# EAGLE design ALSN v1 (EAGLE 9.5.0)
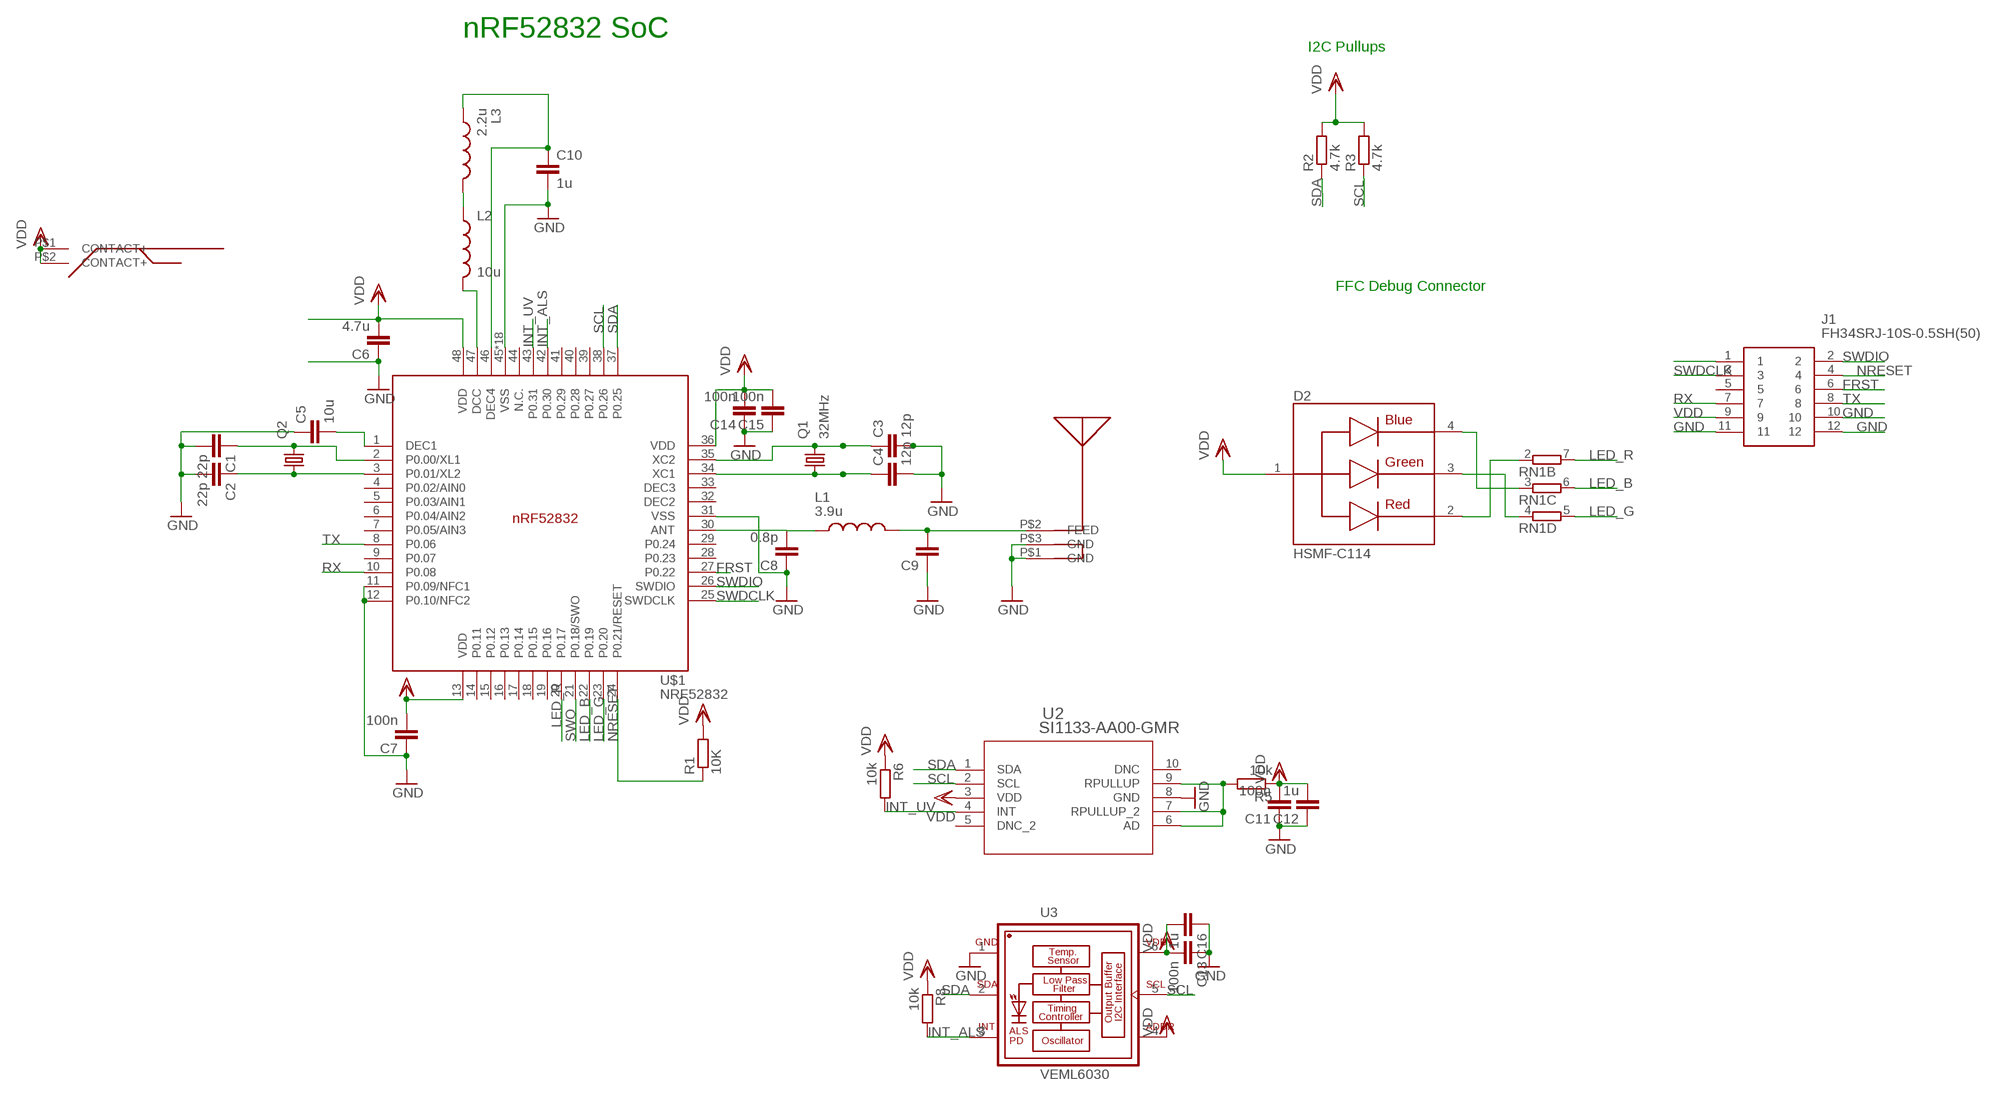
[diagram p0: schematic, sheet 1]

## Parts
C1  22p  CC0402  [C0402]
C2  22p  CC0402  [C0402]
C3  12p  CC0402  [C0402]
C4  12p  CC0402  [C0402]
C5  10u  CC0402  [C0402]
C6  4.7u  CC0402  [C0402]
C7  100n  CC0603R  [C0603R]
C8  0.8p  CC0402  [C0402]
C9  1.2p  CC0402  [C0402]
C10  1u  CC0402  [C0402]
C11  100n  CC0402  [C0402]
C12  1u  CC0402  [C0402]
C13  100n  CC0402  [C0402]
C14  100n  CC0402  [C0402]
C15  100n  CC0402  [C0402]
C16  1u  CC0402  [C0402]
D2  HSMF-C114  [DIOSC160X150X35-4N]
J1  FH34SRJ-10S-0.5SH(50)  [FH34SRJ10S05SH50]
L1  3.9u  MHQ0402P7N5JT000  [INDC0402X26N]
L2  10u  INDUCTOR  [L0603]
L3  2.2u  MHQ0402P7N5JT000  [INDC0402X26N]
Q1  32MHz  KX-5  [2.0X1.6_KX-5]
Q2  KX-327-RT  [2.0X1.2]
R1  10K  RR0402  [R0402]
R2  4.7k  RR0402  [R0402]
R3  4.7k  RR0402  [R0402]
R5  10k  RR0402  [R0402]
R6  10k  RR0402  [R0402]
R8  10k  RR0402  [R0402]
RN1  4R-N0402ARV341  [4X0402ARV341]
U2  SI1133-AA00-GMR  [10QFN_2X2_SIL]
U3  VEML6030  [VISHAY_VEML6030_2X2X0.87]
U$1  NRF52832  [QFN40P600X600X90-48_N]
U$2  CR2032-THT  [CR2032-THT]
U$4  CHIPANTENNAL2  [CHIPANTENNAL2]

## Nets
FRST: J1.6 U$1.27(P0.22)
GND: C1.2 C2.2 C3.2 C4.2 C5.1 C6.1 C7.1 C8.1 C9.1 C10.2 C11.1 C12.1 C13.1 C14.1 C15.1 C16.1 J1.10 J1.11 J1.12 U2.8(GND) U3.1(GND) U$1.11(P0.09/NFC1) U$1.12(P0.10/NFC2) U$1.31(VSS) U$1.45(VSS) U$1.PAD(VSS) U$1.PAD@VIA01(VSS) U$1.PAD@VIA02(VSS) U$1.PAD@VIA03(VSS) U$1.PAD@VIA04(VSS) U$1.PAD@VIA05(VSS) U$1.PAD@VIA06(VSS) U$1.PAD@VIA07(VSS) U$1.PAD@VIA08(VSS) U$1.PAD@VIA09(VSS) U$1.PAD@VIA10(VSS) U$1.PAD@VIA11(VSS) U$1.PAD@VIA12(VSS) U$1.PAD@VIA13(VSS) U$1.PAD@VIA14(VSS) U$1.PAD@VIA15(VSS) U$1.PAD@VIA16(VSS) U$4.P$1(GND) U$4.P$3(GND)
INT_ALS: R8.2 U3.3(INT) U$1.42(P0.30)
INT_UV: R6.2 U2.4(INT) U$1.43(P0.31)
LED_B: RN1.6 U$1.22(P0.19)
LED_G: RN1.5 U$1.23(P0.20)
LED_R: RN1.7 U$1.20(P0.17)
N$1: C1.1 Q2.2 U$1.2(P0.00/XL1)
N$2: C2.1 Q2.1 U$1.3(P0.01/XL2)
N$3: C3.1 Q1.3 U$1.35(XC2)
N$4: C4.1 Q1.1 U$1.34(XC1)
N$5: C5.2 U$1.1(DEC1)
N$6: C8.2 L1.1 U$1.30(ANT)
N$9: L2.2 U$1.47(DCC)
N$10: L2.1 L3.2
N$11: C10.1 L3.1 U$1.46(DEC4)
N$12: D2.3 RN1.4
N$15: R5.2 U2.6(AD) U2.7(RPULLUP_2) U2.9(RPULLUP)
N$16: D2.2 RN1.2
N$17: J1.1
N$18: D2.4 RN1.3
NRESET: J1.4 R1.1 U$1.24(P0.21/RESET)
RF: C9.2 L1.2 U$4.P$2(FEED)
RX: J1.7 U$1.10(P0.08)
SCL: R3.1 U2.2(SCL) U3.5(SCL) U$1.38(P0.26)
SDA: R2.1 U2.1(SDA) U3.2(SDA) U$1.37(P0.25)
SWDCLK: J1.3 U$1.25(SWDCLK)
SWDIO: J1.2 U$1.26(SWDIO)
SWO: U$1.21(P0.18/SWO)
TX: J1.8 U$1.8(P0.06)
VDD: C6.2 C7.2 C11.2 C12.2 C13.2 C14.2 C15.2 C16.2 D2.1 J1.9 R1.2 R2.2 R3.2 R5.1 R6.1 R8.1 U2.3(VDD) U3.4(ADDR) U3.6(VDD) U$1.13(VDD) U$1.36(VDD) U$1.48(VDD) U$2.P$1(CONTACT+) U$2.P$2(CONTACT+)
Unconnected: J1.5 RN1.1 RN1.8 U2.5(DNC_2) U2.10(DNC) U$1.4(P0.02/AIN0) U$1.5(P0.03/AIN1) U$1.6(P0.04/AIN2) U$1.7(P0.05/AIN3) U$1.9(P0.07) U$1.14(P0.11) U$1.15(P0.12) U$1.16(P0.13) U$1.17(P0.14) U$1.18(P0.15) U$1.19(P0.16) U$1.28(P0.23) U$1.29(P0.24) U$1.32(DEC2) U$1.33(DEC3) U$1.39(P0.27) U$1.40(P0.28) U$1.41(P0.29) U$1.44(N.C.)

## Notes on the sheet
- nRF52832 SoC
- I2C Pullups
- FFC Debug Connector

## Library data of the parts
C1-C6 C8-C16 = eagle-ltspice:C: CAPACITOR, European symbol; SPICEMODEL: NONE; SPICEPREFIX: C
C7 = eagle-ltspice:C: CAPACITOR, European symbol
D2 = HSMF-C114:HSMF-C114: LED Tri-Color Blue/Green/Red 468nm/523nm/637nm 4-Pin Chip LED T/R; AVAILABILITY: Unavailable; DESCRIPTION: LED RGB DIFFUSED CHIP SMD; MF: Broadcom Limited; MP: HSMF-C114; PACKAGE: 0606 Broadcom; PRICE: None
J1 = FH34SRJ-10S-0.5SH_50_:FH34SRJ-10S-0.5SH(50): HIROSE(HRS) - FH34SRJ-10S-0.5SH(50) - CONNECTOR, FFC/FPC, RCPT, 10POS, 1ROW Source: Datasheet <https://www.hirose.com/product/en/products/FH34SRJ/FH34SRJ-10S-0.5SH(50)/> Check prices <https://pricing.snapeda.com/search/part/FH34SRJ-10S-0.5SH%2850%29/?ref=eda>; AVAILABILITY: Good; DESCRIPTION: FFC & FPC Connectors 10POS 0.50MM R/A CONN FFC FPC; MF: Hirose Connector; MP: FH34SRJ-10S-0.5SH(50); PACKAGE: None; PRICE: None; PURCHASE-URL: https://pricing.snapeda.com/search/part/FH34SRJ-10S-0.5SH(50)/?ref=eda
L1 L3 = MHQ0402P7N5JT000:MHQ0402P7N5JT000: 221 NH 5% GOLD TERMINAL; AVAILABILITY: Unavailable; DESCRIPTION: FIXED IND 7.5NH 200MA 1.2 OHM; MF: TDK; MP: MHQ0402P7N5JT000; PACKAGE: 0402 TDK; PRICE: None
L2 = BeagleBone_Blue_R3:INDUCTOR: Inductors Basic Inductor/Choke - 0603 and 1206. Footprints are not proven and vary greatly between part numbers. SRN6045- 33uH, 20% 1.4A
Q1 = crystal-geyer_V1_0:KX: Quartz Crystals (MHz) SMD: KX - Serie Model Size l/w/h [mm] Frequency Range Frequency Stability Temp. Range [°C] Load Capacitance AECQ 200 availabel Datasheet KX-4 KX-5 KX-6 KX-7 KX-9A KX-9B KX-12A KX-12B KX-13 KX-20 KX-K KX-KS 1.6/1.2/0.3 2.0/1.6/0.45 2.5/2.0/0.55 3.2/2.5/0.8 5.0/3.2/1.0 5.0/3.2/1.1 6.0/3.5/1.1 6.0/3.5/1.0 7.0/5.0 /1.3 11.6/5.5/1.6 12.3/4.5/4.2 12.3/4.5/3.2 24.0 ~ 80.0 MHz 16.0 ~ 80.0 MHz 12.0 ~ 80.0 MHz 8.0 ~ 60.0 MHz 7,68 ~ 300,0 MHz 8,0 ~ 50,0 MHz 8,0 ~ 150,0 MHz 8,0 ~ 50,0 MHz 6,0 ~ 160,0 MHz 3,579 ~ 25,0 MHz 3,579 ~ 70,0 MHz 3,579 ~ 70,0 MHz ±10 … ±50ppm ±10 … ±50ppm ±10 … ±50ppm ±10 … ±50ppm ±10 … ±50ppm ±10 … ±50ppm ±10 … ±50ppm ±10 … ±50ppm ±10 … ±50ppm ±50ppm ±10 … ±50ppm ±10 … ±50ppm (*) -40°C …+85°C (*) -40°C …+125°C (*) -40°C …+125°C (*) -40°C …+125°C (*) -40°C …+105°C (*) -40°C …+105°C (*) -40°C …+125°C (*) -40°C …+105°C (*) -40°C …+105°C (*) -40°C …+105°C (*) -40°C …+85°C (*) -40°C …+85°C 8, 8…16 8, 8…16 10, 8…16 12, 7…20 16, 10…20 16, 10…20 16, 10…20 16, 12…20 16, 12…20 16, 12…20 16, 12…30 16, 12…30 - yes yes yes - - - - - - - - KX-4.pdf <http://www.geyer-electronic.de/uploads/tx_userartikelfrequenz/GEYER-KX-4.pdf> KX-5.pdf <http://www.geyer-electronic.de/uploads/tx_userartikelfrequenz/GEYER-KX-5.pdf> KX-6.pdf <http://www.geyer-electronic.de/uploads/tx_userartikelfrequenz/GEYER-KX-6.pdf> KX-7.pdf <http://www.geyer-electronic.de/uploads/tx_userartikelfrequenz/GEYER-KX-7.pdf> KX-9A.pdf <http://www.geyer-electronic.de/uploads/tx_userartikelfrequenz/GEYER-KX-9A.pdf> KX-9B.pdf <http://www.geyer-electronic.de/uploads/tx_userartikelfrequenz/GEYER-KX-9B.pdf> KX-12A.pdf <http://www.geyer-electronic.de/uploads/tx_userartikelfrequenz/GEYER-KX-12A.pdf> KX-12B.pdf <http://www.geyer-electronic.de/uploads/tx_userartikelfrequenz/GEYER-KX-12B.pdf> KX-13.pdf <http://www.geyer-electronic.de/uploads/tx_userartikelfrequenz/GEYER-KX-13.pdf> KX-20.pdf <http://www.geyer-electronic.de/uploads/tx_userartikelfrequenz/GEYER-KX-20.pdf> KX-K.pdf <http://www.geyer-electronic.de/uploads/tx_userartikelfrequenz/GEYER-KX-K.pdf> KX-KS.pdf <http://www.geyer-electronic.de/uploads/tx_userartikelfrequenz/GEYER-KX-KS.pdf> <http://www.geyer-electronic.de/fileadmin/template/img/logo-geyer-electronic.png> Details see: http://www.geyer-electronic.de/Frequenz-Produkte.9.0.html Created 2016-06-07, Hans Locher 2016 (C) Geyer Quartz Technology KX4,KX5,KX6,KX7,KX9A,KX9B,KX12A,KX12B,KX13,KX20,KXK,KXKS;1612;2016;2520;3225;5032;6035;7050;11655;12345;1,6x1,2;2,0x1,6;2,5x2,0;3,2x2,5;5,0x3,2;6,0x3,5;7,0x5,0;11,6x5,5;12,3x4,5;12,3x4,5;1.6x1.2;2.0x1.6;2.5x2.0;3.2x2.5;5.0x3.2;6.0x3.5;7.0x5.0;11.6x5.5;12.3x4.5;12.3x4.5;
Q2 = crystal-geyer_V1_0:KX-327: Tuning Fork Crystals (kHz) SMD: KX327 - Serie Model Size l/w/h [mm] Frequency Range Frequency Stability Temp. Range [°C] Load Capacitance AECQ 200 availabel Datasheet KX-327VT KX-327FT KX-327RT KX-327NHT KX-327NHF KX-327L KX-327S 1.25/1.05/0.5 1.6/1.0/0.5 2.0/1.2/0.6 3.2/1.5/0.8 3.2/1.5/0.8 7.0/1.5/1.4 8.2/3.8/2.5 32,768 kHz 32,768 kHz 32,768 kHz 32,768 kHz 32,768 kHz 32,768 kHz 32,768 kHz ±10 … ±20ppm ±10 … ±20ppm ±10 … ±20ppm ±10 … ±20ppm ±10 … ±20ppm ±10 … ±20ppm ±5 … ±20ppm (*) -40°C …+85°C (*) -40°C …+85°C (*) -40°C …+85°C (*) -40°C …+85°C (*) -40°C …+125°C (*) -40°C …+85°C (*) -40°C …+85°C 7/9/12,5 7/9/12,5 7/9/12,6 7/9/12,5 9/12,5 7/9/12,5 6/12,5 - - - - yes - - KX-327VT.pdf <http://www.geyer-electronic.de/uploads/tx_userartikelfrequenz/GEYER-KX-327VT.pdf> KX-327FT.pdf <http://www.geyer-electronic.de/uploads/tx_userartikelfrequenz/GEYER-KX-327FT.pdf> KX-327RT.pdf <http://www.geyer-electronic.de/uploads/tx_userartikelfrequenz/GEYER-KX-327RT.pdf> KX-327NHT.pdf <http://www.geyer-electronic.de/uploads/tx_userartikelfrequenz/GEYER-KX-327NHT.pdf> KX-327NHF.pdf <http://www.geyer-electronic.de/uploads/tx_userartikelfrequenz/GEYER-KX-327NHF.pdf> KX-327L.pdf <http://www.geyer-electronic.de/uploads/tx_userartikelfrequenz/GEYER-KX-327L.pdf> KX-327S.pdf <http://www.geyer-electronic.de/uploads/tx_userartikelfrequenz/GEYER-KX-327S.pdf> <http://www.geyer-electronic.de/fileadmin/template/img/logo-geyer-electronic.png> Details see: http://www.geyer-electronic.de/Frequenz-Produkte.9.0.html Created 2016-06-07, Hans Locher 2016 (C) Geyer Quartz Technology KX327VT,KX327FT,KX327RT,KX327NHT,KX327NHF,KX327S,KX327L;125105;1610;2012;3215;7015;8238;1,25x1,05,1.25x1.05;1,6x1,0,1.6x1.0;2,0x1,2,2.0x1.2;3,2x1,5,3.2x1.5;8,2x3,8,8.2x3.8,7.0x1.5,7,0x1,532.768kHz
R1-R3 R5 R6 R8 = eagle-ltspice:R: RESISTOR, European symbol; SPICEMODEL: NONE; SPICEPREFIX: R
RN1 = resistor-dil:4R-N: Array Chip Resistor Source: RS Component / Phycomp; OC_FARNELL: unknown; OC_NEWARK: unknown
U2 = Si1133:SI1133-AA00-GMR; BUILT_BY: EMA_Justin; COPYRIGHT: Copyright (C) 2018 Accelerated Designs. All rights reserved; MANUFACTURER_PART_NUMBER: SI1133-AA00-GMR; SOURCELIBRARY: Silicon_Labs_2019-11-20; VENDOR: Silicon Labs
U3 = VEML6030:VEML6030: VEML6030 High Accuracy Ambient Light Sensor with I2C Interface: VEML6030 is a high accuracy ambient light digital 16-bit resolution sensor in a miniature transparent 2 mm x 2 mm package. It includes a high sensitive photodiode, a low noise amplifier, a 16-bit A/D converter and supports an easy to use I2C bus communication interface and additional interrupt feature. The ambient light result is as digital value available. Device Model created 15.06.2016 by Johannes Kolb - Vishay Semiconductor GmbH Check prices <https://pricing.snapeda.com/parts/VEML6030/Vishay/view-part?ref=eda>; AVAILABILITY: In Stock; DESCRIPTION: Optical Sensor Ambient 550nm I²C 6-SMD, No Lead; MF: Vishay; MP: VEML6030; PACKAGE: SMD-6 Vishay; PRICE: None
U$1 = Nordic_nRF:NRF52832: nRF52832 Features Single chip, highly flexible, 2.4 GHz multi-protocol SoC 32-bit ARM Cortex-M4F Processor 1.7v to 3.6v operation 512kB flash + 64kB RAM Supports concurrent Bluetooth Smart/ANT protocol operation On-chip NFC tag for Out-of-Band (OOB) pairing Up to +4dBm output power -96dBm sensitivity, Bluetooth Smart Thread safe and run-time protected Event driven API On air compatible with nRF24L and nRF24AP series 2 data rates (2Mbps/1Mbps) PPI - maximum flexibility for power-efficient applications and code simplification Automated power management system with automatic power management of each peripheral Configurable I/O mapping for analog and digital I/O 3 x Master/Slave SPI 2 x Two-wire interface (I²C) UART (RTS/CTS) 3 x PWM AES HW encryption Real Time Counter (RTC) Digital microphone interface (PDM) On-chip balun Applications Internet of Things (IoT) Wearables SmartHome sensors Connected white goods Computer peripherals Voice-command smart remotes A4WP ‘Rezence’ wireless charging Beacons Sports and fitness sensors and hubs Connected health products Smart watches RC Toys Interactive games Building automation and sensor networks
U$2 = cr2032-tht:CR2032-THT
U$4 = CHIPANTENNA:CHIPANTENNAL2

## Board
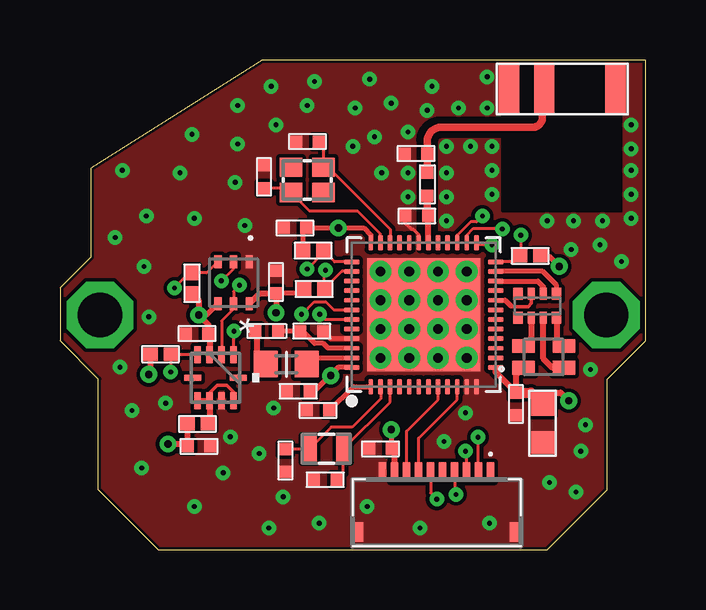
[diagram p1: board, top side]
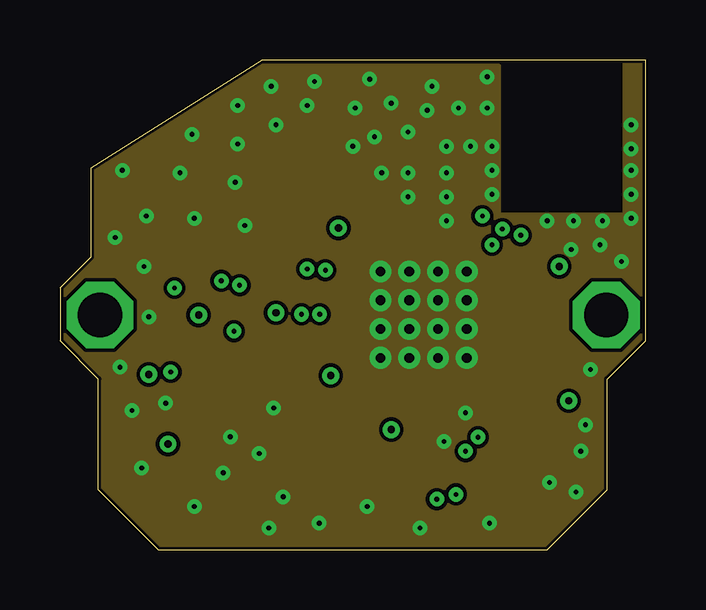
[diagram p2: board, inner layer Route2]
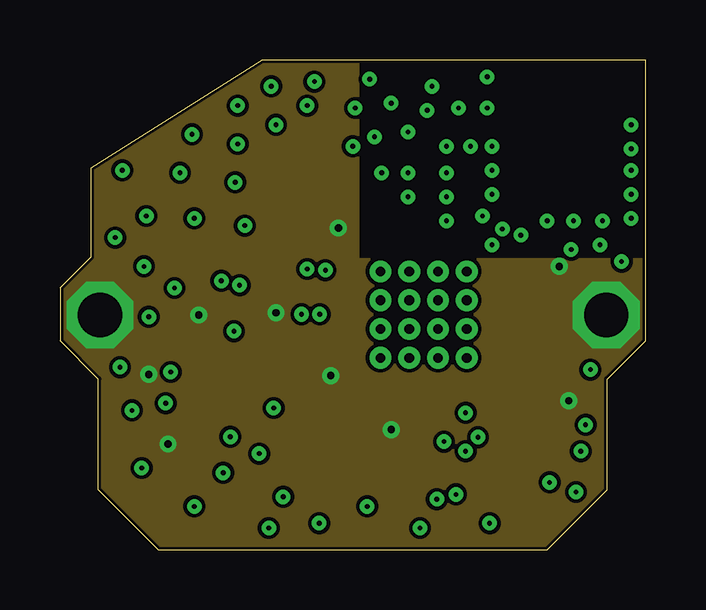
[diagram p3: board, inner layer Route15]
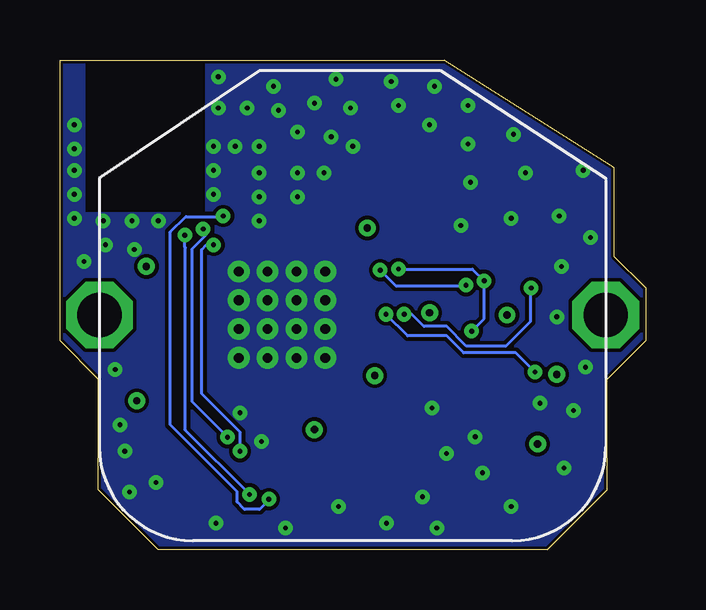
[diagram p4: board, bottom side, seen from below]

Size 24.4 x 20.4 mm. Coordinates in mm from the lower left corner, seen from the top.
Outline: 4.1,0 20.3,0 22.8,2.5 22.8,7.1 24.4,8.7 24.4,20.4 8.4,20.4 1.3,15.92 1.3,12.2 0,10.9 0,8.7 1.6,7.1 1.6,2.5 4.1,0
Copper layers (1+2*15+16): Top 0.035mm / dielectric 0.2mm / Route2 0.035mm / dielectric 0.45mm / Route15 0.035mm / dielectric 0.2mm / Bottom 0.035mm
Design rules "default *": minimum track width 5mil, minimum drill 0.2mm, track to track 6mil, track to pad 6mil, pad to pad 6mil, via to via 6mil, smd to smd 6mil, copper to edge 5mil, drill to drill 6mil, minimum pad ring 10mil, minimum via ring 8mil, stop-mask expansion 0mil, vias tented up to drill 40mil, thermal gap 0mil
tRestrict: 6 lines

### Footprints (pad centres in the part's own frame; a part is rotated, then mirrored left to right if it is on the bottom)
C0402 = smd 0.5 x 0.5: 1 -0.475,0; 2 0.475,0
C0603R = smd 0.95 x 0.95: 1 -0.85,0; 2 0.75,0
DIOSC160X150X35-4N = smd 0.94 x 0.57: 1 -0.845,-0.45; 2 -0.845,0.45; 3 0.845,0.45; 4 0.845,-0.45
FH34SRJ10S05SH50 = smd 0.3 x 0.8: 1 2.25,1.55; 2 1.75,1.55; 3 1.25,1.55; 4 0.75,1.55; 5 0.25,1.55; 6 -0.25,1.55; 7 -0.75,1.55; 8 -1.25,1.55; 9 -1.75,1.55; 10 -2.25,1.55 | smd 0.4 x 0.8: 11 -3.25,-0.95; 12 3.25,-0.95
INDC0402X26N = smd 0.5 x 0.5: 1 -0.732,0; 2 0.232,0
L0603 = smd 1 x 1.1: 1 -0.85,0; 2 0.85,0
2.0X1.6_KX-5 = smd 0.95 x 0.8: 1 -0.675,-0.525; 2 0.675,-0.525; 3 0.675,0.525; 4 -0.675,0.525
2.0X1.2 = smd 0.6 x 1.1: 1 -0.7,0; 2 0.7,0
R0402 = smd 0.6 x 0.55: 1 -0.425,0; 2 0.425,0
4X0402ARV341 = smd 0.4 x 0.5: 1 -0.8,-0.5; 4 0.8,-0.5; 5 0.8,0.5; 8 -0.8,0.5 | smd 0.3 x 0.5: 2 -0.25,-0.5; 3 0.25,-0.5; 6 0.25,0.5; 7 -0.25,0.5
10QFN_2X2_SIL = smd 0.706 x 0.255: 1 -0.95,0.75; 2 -0.95,0.25; 3 -0.95,-0.25; 4 -0.95,-0.75; 6 0.95,-0.75; 7 0.95,-0.25; 8 0.95,0.25; 9 0.95,0.75 | smd 0.255 x 0.706: 5 0,-0.95; 10 0,0.95
VISHAY_VEML6030_2X2X0.87 = smd 0.55 x 0.3: 1 -0.875,0.65; 2 -0.875,0; 3 -0.875,-0.65; 4 0.875,-0.65; 5 0.875,0; 6 0.875,0.65
QFN40P600X600X90-48_N = smd 0.65 x 0.2: 1 -3,2.2; 2 -3,1.8; 3 -3,1.4; 4 -3,1; 5 -3,0.6; 6 -3,0.2; 7 -3,-0.2; 8 -3,-0.6; 9 -3,-1; 10 -3,-1.4; 11 -3,-1.8; 12 -3,-2.2; 25 3,-2.2; 26 3,-1.8; 27 3,-1.4; 28 3,-1; 29 3,-0.6; 30 3,-0.2; 31 3,0.2; 32 3,0.6; 33 3,1; 34 3,1.4; 35 3,1.8; 36 3,2.2 | smd 0.2 x 0.65: 13 -2.2,-3; 14 -1.8,-3; 15 -1.4,-3; 16 -1,-3; 17 -0.6,-3; 18 -0.2,-3; 19 0.2,-3; 20 0.6,-3; 21 1,-3; 22 1.4,-3; 23 1.8,-3; 24 2.2,-3; 37 2.2,3; 38 1.8,3; 39 1.4,3; 40 1,3; 41 0.6,3; 42 0.2,3; 43 -0.2,3; 44 -0.6,3; 45 -1,3; 46 -1.4,3; 47 -1.8,3; 48 -2.2,3 | smd 4.7 x 4.7: PAD 0,0 | drill 0.4: PAD@VIA01 -1.8,1.8; PAD@VIA02 -1.8,0.6; PAD@VIA03 -1.8,-0.6; PAD@VIA04 -1.8,-1.8; PAD@VIA05 -0.6,1.8; PAD@VIA06 -0.6,0.6; PAD@VIA07 -0.6,-0.6; PAD@VIA08 -0.6,-1.8; PAD@VIA09 0.6,1.8; PAD@VIA10 0.6,0.6; PAD@VIA11 0.6,-0.6; PAD@VIA12 0.6,-1.8; PAD@VIA13 1.8,1.8; PAD@VIA14 1.8,0.6; PAD@VIA15 1.8,-0.6; PAD@VIA16 1.8,-1.8
CR2032-THT = drill 1.85 octagon: P$1 0,0; P$2 21.1,0
CHIPANTENNAL2 = smd 0.85 x 2: P$1 0.45,1; P$2 1.925,1; P$3 4.9,1

### Placement (x,y rotation side)
C1  9.39,3.71 270 top
C2  11.05,2.91 180 top
C3  8.5,15.53 90 top
C4  10.31,17 180 top
C5  10.75,5.8 0 top
C6  5.79,4.3 180 top
C7  20.11,5.31 90 top
C8  14.87,13.9 0 top
C9  14.83,16.5 0 top
C10  10.49,9.1 0 top
C11  9,11.15 270 top
C12  5.71,9 0 top
C13  19,6.07 90 top
C14  9.93,6.6 0 top
C15  9.79,13.4 0 top
C16  13.35,4.2 0 top
D2  20.15,8.03 0 top
J1  15.69,1.68 0 top
L1  15.31,15.47 90 top
L2  9.43,7.73 0 top
L3  8.37,9.11 180 top
Q1  10.3,15.4 180 top
Q2  11.1,4.2 180 top
R1  19.59,12.24 0 top
R2  10.55,12.46 180 top
R3  10.59,10.86 180 top
R5  5.73,5.24 0 top
R6  4.19,8.14 0 top
R8  5.5,11.1 90 top
RN1  19.89,10.15 0 top
U2  6.48,7.16 270 top
U3  7.23,11.12 270 top
U$1  15.15,9.79 90 top
U$2  22.76,9.77 180 top
U$4  18.25,18.19 0 top

### Tracks (layer width: path | path; a pad name or v marks a point on that pad's centre or on a via)
FRST  (via drill 0.2)
  Top 0.127: J1.6 15.44,2.36 v15.7,2.1 | v17.6,13.9 17.36,13.66 17.11,13.66 16.55,13.1 U$1.27
  Bottom 0.127: v15.7,2.1 15.7,2.07 16.09,1.68 16.71,1.68 17.02,1.99 17.02,2.42 19.8,5.2 19.8,13.23 19.16,13.88 17.62,13.88 v17.6,13.9
GND  (via drill 0.2)
  Top 0.152: U$1.31 14.95,13.12 14.73,13.34 14.66,13.34 14.39,13.61 C8.1
  Top 0.203: U$1.45 11.28,8.79 C10.2
  other vias: 14.5,14.7 17.8,19.7 17.8,18.4 16.6,18.4 15.3,18.3 16.1,16.8 14.5,17.4 18,14.8 20.3,13.7 21.4,13.7 22.6,13.7 23.8,13.8 23.8,14.8 23.8,15.8 23.8,16.7 23.8,17.7 16.1,13.7 16.1,14.7 16.1,15.7 18,15.8 18,16.8 17.1,16.8 14.5,15.7 10.8,1.1 8.8,19.3 13.1,17.2 22.1,7.5 21.3,12.5 23.4,12 7.7,13.5 21.7,4.1 21.9,5.2 2.6,15.8 5,15.7 5.5,17.3 21.5,2.4 7.1,4.7 16.9,5.7 5.6,13.8 12.3,18.4 7.4,16.9 12.9,19.6 17.9,1.1 15.5,19.3 13.8,18.6 3.7,9.7 2.5,7.6 3.5,11.8 20.4,2.8 6.8,3.2 8.7,0.9 16,4.5 10.6,19.5 10.3,18.5 13.4,15.7 12.8,1.8 7.4,18.5 7.3,15.3 8.9,5.9 15,0.9 2.3,13 3.6,13.9 5.6,1.8 3.4,3.4 4.4,6.1 3,5.8 8.3,4 9.3,2.2 9,17.7 12.2,16.8 22.5,12.7
  pour Top: 1.3,16.1 5.7,20.5 18.1,20.5 18.3,20.5 18.3,14.1 18.4,14 24.4,14 24.4,2.6 22.1,0.3 21.8,0 6.3,0 2.7,0 0.1,2.6 0,2.7 0,11.3 0,14.8
  pour Top: 23.5,14 23.5,20.4 24.4,20.4 24.4,14 24.3,13.9 23.6,13.9
  pour Route2: -0.1,14.5 5.6,20.2 18.3,20.2 18.3,14 24.3,14 24.3,2.3 21.7,-0.3 2.6,-0.3 -0.1,2.4
  pour Route2: 23.5,13.8 23.5,20.3 24.4,20.3 24.4,13.9 24.3,13.8
  pour Bottom: -0.1,14.7 5.6,20.4 18.3,20.4 18.3,14 24.3,14 24.3,2.5 21.7,-0.1 2.6,-0.1 -0.1,2.6
  pour Bottom: 23.4,14 23.4,20.5 24.3,20.5 24.3,14.1 24.2,14
INT_ALS  (via drill 0.2)
  Top 0.127: U3.3 6.11,11.53 R8.2 5.39,11.53 v4.77,10.9 | v10.06,9.81 10.09,9.81 10.6,10.32 11.07,10.32 11.41,9.99 U$1.42
  Bottom 0.127: v4.77,10.9 4.8,10.87 4.8,9.5 5.82,8.48 7.46,8.48 8.28,9.3 9.24,9.3 9.74,9.81 v10.06,9.81
INT_UV  (via drill 0.2)
  Top 0.127: U2.4 4.64,8.11 R6.2 v4.62,7.41 v4.61,7.4 | v10.82,9.81 11.04,9.59 U$1.43
  Bottom 0.127: v4.61,7.4 5.41,8.2 7.58,8.2 8.28,8.9 9.91,8.9 v10.82,9.81
LED_B
  Top 0.2: U$1.22 19.91,11.19 20.14,10.96 RN1.6
LED_G
  Top 0.2: RN1.5 20.69,11.01 20.11,11.59 U$1.23
LED_R
  Top 0.152: 18.78,10.15 18.8,10.13 19.5,10.13 19.64,10.27 RN1.7
  Top 0.2: U$1.20 18.54,10.39 18.78,10.15
N$1
  Top 0.127: U$1.2 13.37,6.77 13.37,6.29 12.17,5.1 11.3,5.1 Q2.2 9.4,4.2 C1.1
N$2
  Top 0.127: U$1.3 13.75,6.15 Q2.1 11.8,3.19 C2.1
N$3
  Top 0.127: U$1.35 13.35,13.15 12.4,14.1 10.4,14.1 Q1.3 9.45,15.05 C3.1
N$4
  Top 0.127: C4.1 10.97,16.81 Q1.1 11.18,15.93 13.75,13.35 U$1.34
N$5
  Top 0.203: C5.2 12.21,6.79 U$1.1
N$6
  Top 0.254: U$1.30 C8.2 arc90 C8.2
  Top 0.305: C8.2 15.31,13.94 L1.1
N$9
  Top 0.203: L2.2 10.54,7.99 U$1.47
N$10
  Top 0.203: 8.22,9.02 L3.2
  Top 0.254: L2.1 8.22,8.09 8.22,9.02
N$11
  Top 0.203: L3.1 9.11,9.1 C10.1 10.11,9.1 10.61,8.6 10.97,8.6 11.17,8.39 U$1.46
N$12
  Top 0.254: RN1.4 20.69,8.79 D2.3
N$15
  Top 0.152: U2.9 7.23,6.56 6.94,6.84 6.54,6.84 6.23,6.53 U2.7
  Top 0.254: R5.2 6.23,5.32 U2.7 U2.6
N$16
  Top 0.254: RN1.2 19.64,8.81 D2.2
N$18
  Top 0.254: D2.4 20.52,7.58 20.14,7.96 RN1.3
NRESET  (via drill 0.2)
  Top 0.127: U$1.24 18.91,11.99 R1.1 19.2,12.28 v19.2,13.1 | J1.4 16.44,2.36 v16.5,2.3
  Bottom 0.127: v16.5,2.3 19.18,4.98 19.18,12.58 19.2,12.6 v19.2,13.1
RF
  Top 0.305: L1.2 C9.2 15.3,17 arc90 15.3,17 arc-90 15.9,17.6 19.7,17.6 arc90 20.1,18 20.1,19.11 arc-90 U$4.P$2
RX
  Top 0.127: J1.7 14.94,4.64 16.55,6.25 U$1.10
SCL  (via drill 0.2)
  Top 0.127: U$1.38 11.74,11.59 R3.1 11.02,11.6 v11.06,11.64 | v7.48,11.02 7.23,10.76 U3.5 7.23,10.03 6.73,9.53 U2.2
  Bottom 0.127: v11.06,11.64 10.42,11 7.5,11 v7.48,11.02
SDA  (via drill 0.2)
  Top 0.127: U$1.37 11.45,11.99 R2.1 10.97,12.37 v10.3,11.69 | v6.72,11.2 7.23,11.71 U3.2 | U2.1 7.23,9.1 v7.25,9.1
  Bottom 0.127: v10.3,11.69 7.21,11.69 v6.72,11.2 6.72,9.62 v7.25,9.1
SWDCLK  (via drill 0.2)
  Top 0.127: J1.3 16.94,4.06 v16.9,4.1 | v18,12.7 17.44,12.7 U$1.25
  Bottom 0.127: v16.9,4.1 16.9,4.9 18.5,6.5 18.5,12.5 18.3,12.7 v18,12.7
SWDIO  (via drill 0.2)
  Top 0.127: J1.2 17.42,3.25 v17.42,4.68 | U$1.26 16.95,13.1 17.23,13.38 18.41,13.38 v18.43,13.36
  Bottom 0.127: v17.42,4.68 18.9,6.17 18.9,12.53 18.33,13.1 18.33,13.26 v18.43,13.36
TX
  Top 0.127: J1.8 14.44,4.94 15.75,6.25 U$1.8
VDD  (via drill 0.3)
  Top 0.2: v11.6,13.4 12.65,13.4 12.95,13.1 U$1.36 | C16.2 13.82,4.97 v13.8,5
  Top 0.203: C14.2 10.6,6.6 11.29,7.29 | U$1.48 11.59,7.59 11.29,7.29 | 11.29,7.29 v11.29,7.25 | R3.2 9.98,10.68 C11.2 | R2.2 10.12,13.26 C15.2 v11.6,13.4 | R1.2 20.36,12.24 v20.8,11.8 | v5.78,9.78 6.11,9.78 U3.4
  Top 0.254: U$1.13 18.15,7.39 C13.2 19,7.28 D2.1 | J1.9 13.94,4.08 C16.2 | U3.6 8.31,10.68 C11.2 v9,9.87 | U2.3 6.23,8.96 C12.2 6.18,9.37 v5.78,9.78 5.78,10.4 R8.1 | R5.1 C6.2 5.21,4.4 v4.5,4.4 | R6.1 3.77,7.37 v3.7,7.3 | 19.62,6.54 20.86,6.54 v21.2,6.2
  Top 0.406: C13.2 19.62,6.54 C7.2
  pour Route15: 0.2,14.8 5.9,20.5 12.4,20.5 12.4,12.1 24.6,12.1 24.6,2.6 22,0 2.9,0 0.2,2.7